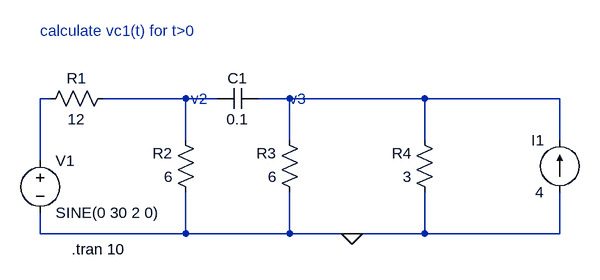
[diagram p0: schematic Lab5_ques3.asc]
Lab5_ques3.asc, the LTspice schematic file:
Version 4
SHEET 1 916 680
WIRE 96 208 80 208
WIRE 304 208 176 208
WIRE 352 208 304 208
WIRE 464 208 416 208
WIRE 672 208 464 208
WIRE 880 208 672 208
WIRE 304 272 304 208
WIRE 464 272 464 208
WIRE 672 272 672 208
WIRE 880 272 880 208
WIRE 80 304 80 208
WIRE 80 416 80 384
WIRE 304 416 304 352
WIRE 304 416 80 416
WIRE 464 416 464 352
WIRE 464 416 304 416
WIRE 560 416 464 416
WIRE 672 416 672 352
WIRE 672 416 560 416
WIRE 880 416 880 352
WIRE 880 416 672 416
FLAG 560 416 0
SYMBOL Res 192 192 R90
WINDOW 0 0 56 VBottom 2
WINDOW 3 32 56 VTop 2
SYMATTR InstName R1
SYMATTR Value 12
SYMBOL Res 320 368 R180
WINDOW 0 36 76 Left 2
WINDOW 3 36 40 Left 2
SYMATTR InstName R2
SYMATTR Value 6
SYMBOL Res 480 368 R180
WINDOW 0 36 76 Left 2
WINDOW 3 36 40 Left 2
SYMATTR InstName R3
SYMATTR Value 6
SYMBOL Res 688 368 R180
WINDOW 0 36 76 Left 2
WINDOW 3 36 40 Left 2
SYMATTR InstName R4
SYMATTR Value 3
SYMBOL Cap 416 192 R90
WINDOW 0 0 32 VBottom 2
WINDOW 3 32 32 VTop 2
SYMATTR InstName C1
SYMATTR Value 0.1
SYMBOL Voltage 80 288 R0
SYMATTR InstName V1
SYMATTR Value SINE(0 30 2 0)
SYMBOL current 880 352 R180
WINDOW 0 24 80 Left 2
WINDOW 3 24 0 Left 2
SYMATTR InstName I1
SYMATTR Value 4
TEXT 80 104 Left 2 ;calculate vc1(t) for t>0
TEXT 128 440 Left 2 !.tran 10
TEXT 312 208 Left 2 ;v2
TEXT 464 208 Left 2 ;v3

The netlist it stands for:
* Lab5_ques3.asc
R1 N002 N001 12
R2 0 N002 6
R3 0 N003 6
R4 0 N003 3
C1 N003 N002 0.1
V1 N001 0 SINE(0 30 2 0)
I1 0 N003 4
* calculate vc1(t) for t>0
.tran 10
* v2
* v3
.backanno
.end